# Altium schematic sheet OVP.SchDoc
size 420 x 297 mm; SheetNumber: 13; SheetTotal: 20
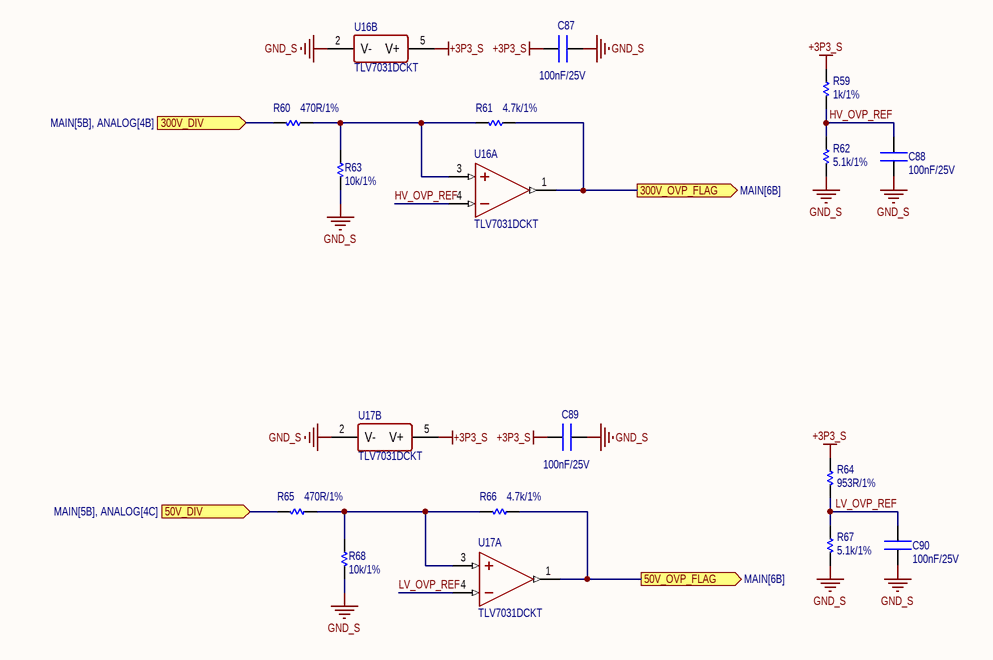
[diagram p0: OVP.SchDoc]

## Parts
C87  100nF/25V  [CN-SMD-0603]
C88  100nF/25V  [CN-SMD-0603]
C89  100nF/25V  [CN-SMD-0603]
C90  100nF/25V  [CN-SMD-0603]
R59  1k/1%  [RES-SMD-0603]
R60  470R/1%  [RES-SMD-0603]
R61  4.7k/1%  [RES-SMD-0603]
R62  5.1k/1%  [RES-SMD-0603]
R63  10k/1%  [RES-SMD-0603]
R64  953R/1%  [RES-SMD-0603]
R65  470R/1%  [RES-SMD-0603]
R66  4.7k/1%  [RES-SMD-0603]
R67  5.1k/1%  [RES-SMD-0603]
R68  10k/1%  [RES-SMD-0603]
U16  TLV7031DCKT  [SOT353]  (parts A,B of 2)
U17  TLV7031DCKT  [SOT353]  (parts A,B of 2)

## Ports
50V_DIV (in, see MAIN[5B], ANALOG[4C]), 50V_OVP_FLAG (out, see MAIN[6B]), 300V_DIV (in, see MAIN[5B], ANALOG[4B]), 300V_OVP_FLAG (out, see MAIN[6B])

## Nets
+3P3_S: C87.1 C89.1 R59.1 R64.1 U16.5(V+) U17.5(V+)
GND_S: C87.2 C88.1 C89.2 C90.1 R62.2 R63.2 R67.2 R68.2 U16.2(V-) U17.2(V-)
50V_DIV: R65.2 ; port 50V_DIV
50V_OVP_FLAG: R66.1 U17.1(OUT) ; port 50V_OVP_FLAG
300V_DIV: R60.2 ; port 300V_DIV
300V_OVP_FLAG: R61.1 U16.1(OUT) ; port 300V_OVP_FLAG
HV_OVP_REF: C88.2 R59.2 R62.1 U16.4(IN-)
LV_OVP_REF: C90.2 R64.2 R67.1 U17.4(IN-)
NetR60_1: R60.1 R61.2 R63.1 U16.3(IN+)
NetR65_1: R65.1 R66.2 R68.1 U17.3(IN+)

## Notes on the sheet
- Project:
- Sub-system:
- Design by:
- Sheet title:
- Sheet
- of
- Checked by:
- Approved by:
- Document No:
- Revision:
- Size:
- Date:

## Library data of the parts
C87-C90 = CN: CAP CER 0.1UF 25V X7R 0603; PN: CL10B104KA8NNNC
R59 = Res-SMD: RES SMD 1K OHM 1% 1/10W 0603; Manufacturer: Generic Components; PN: ERJ-3EKF1001V; Class: Passive; Publisher: Altium Hobart Technology Centre
R60 R65 = Res-SMD: RES 470 OHM 1% 1/10W 0603; Manufacturer: Generic Components; PN: RC0603FR-07470RL; Class: Passive; Publisher: Altium Hobart Technology Centre
R61 R66 = Res-SMD: RES SMD 4.7K OHM 1% 1/10W 0603; Manufacturer: Generic Components; PN: ERJ-3EKF4701V; Class: Passive; Publisher: Altium Hobart Technology Centre
R62 R67 = Res-SMD: RES SMD 5.1K OHM 1% 1/10W 0603; Manufacturer: Generic Components; PN: ERJ-3EKF5101V; Class: Passive; Publisher: Altium Hobart Technology Centre
R63 R68 = Res-SMD: RES SMD 10K OHM 1% 1/10W 0603; Manufacturer: Generic Components; PN: ERJ-3EKF1002V; Class: Passive; Publisher: Altium Hobart Technology Centre
R64 = Res-SMD: RES SMD 953 OHM 1% 1/10W 0603; Manufacturer: Generic Components; PN: ERJ-3EKF9530V; Class: Passive; Publisher: Altium Hobart Technology Centre
U16 U17 = OPA340DBV: IC COMPARATOR 1 GEN PUR SC70-5; PN: TLV7031DCKT